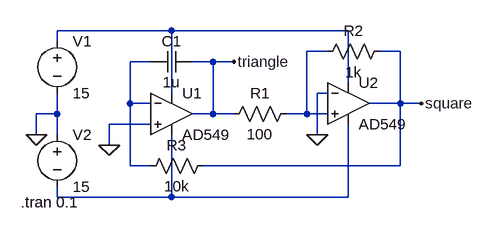
[diagram p0: schematic SquareAndTriangle.asc]
SquareAndTriangle.asc, the LTspice schematic file:
Version 4
SHEET 1 880 680
WIRE 96 -16 -80 -16
WIRE 368 -16 96 -16
WIRE -80 0 -80 -16
WIRE 336 16 304 16
WIRE 448 16 416 16
WIRE 64 32 32 32
WIRE 160 32 128 32
WIRE 192 32 160 32
WIRE 368 64 368 -16
WIRE 96 80 96 -16
WIRE 336 80 320 80
WIRE 32 96 32 32
WIRE 64 96 32 96
WIRE 448 96 448 16
WIRE 448 96 400 96
WIRE 480 96 448 96
WIRE -80 112 -80 80
WIRE -80 112 -112 112
WIRE 160 112 160 32
WIRE 160 112 128 112
WIRE 192 112 160 112
WIRE 304 112 304 16
WIRE 304 112 272 112
WIRE 336 112 304 112
WIRE 64 128 0 128
WIRE -112 144 -112 112
WIRE -80 144 -80 112
WIRE 320 144 320 80
WIRE 0 160 0 128
WIRE 32 192 32 96
WIRE 64 192 32 192
WIRE 448 192 448 96
WIRE 448 192 144 192
WIRE -80 240 -80 224
WIRE 96 240 96 144
WIRE 96 240 -80 240
WIRE 368 240 368 128
WIRE 368 240 96 240
FLAG 0 160 0
FLAG -112 144 0
FLAG 320 144 0
FLAG 192 32 triangle
FLAG 480 96 square
SYMBOL Opamps\\AD549 96 48 R0
SYMATTR InstName U1
SYMBOL Opamps\\AD549 368 32 R0
SYMATTR InstName U2
SYMBOL res 288 96 R90
WINDOW 0 0 56 VBottom 2
WINDOW 3 32 56 VTop 2
SYMATTR InstName R1
SYMATTR Value 100
SYMBOL res 160 176 R90
WINDOW 0 0 56 VBottom 2
WINDOW 3 32 56 VTop 2
SYMATTR InstName R3
SYMATTR Value 10k
SYMBOL cap 128 16 R90
WINDOW 0 0 32 VBottom 2
WINDOW 3 32 32 VTop 2
SYMATTR InstName C1
SYMATTR Value 1u
SYMBOL voltage -80 -16 R0
WINDOW 123 0 0 Left 0
WINDOW 39 0 0 Left 0
SYMATTR InstName V1
SYMATTR Value 15
SYMBOL voltage -80 128 R0
WINDOW 123 0 0 Left 0
WINDOW 39 0 0 Left 0
SYMATTR InstName V2
SYMATTR Value 15
SYMBOL res 432 0 R90
WINDOW 0 0 56 VBottom 2
WINDOW 3 32 56 VTop 2
SYMATTR InstName R2
SYMATTR Value 1k
TEXT -136 248 Left 2 !.tran 0.1

The netlist it stands for:
* SquareAndTriangle.asc
XU1 0 N003 N001 N004 triangle AD549  ; pins In+ In- V+ V- OUT
XU2 N002 0 N001 N004 square AD549  ; pins In+ In- V+ V- OUT
R1 N002 triangle 100
R3 square N003 10k
C1 triangle N003 1u
V1 N001 0 15
V2 0 N004 15
R2 square N002 1k
.tran 0.1
.backanno
.end